# Altium project GLCD_Board.PrjPcb
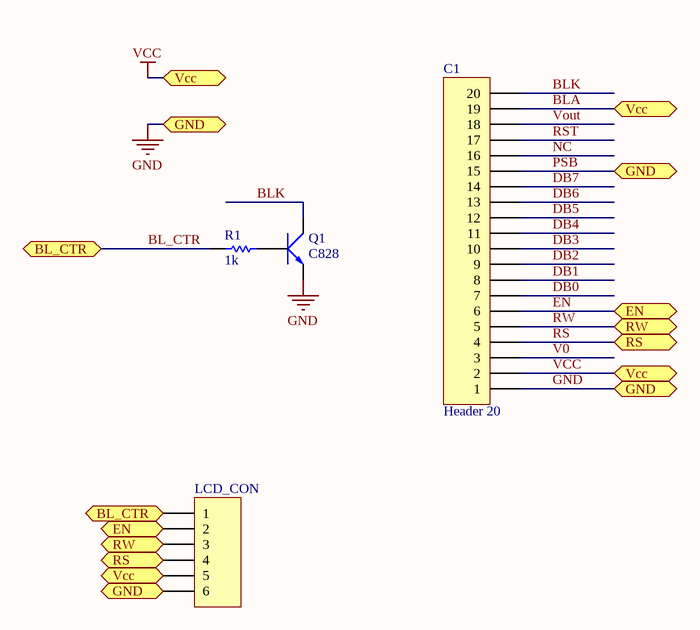
[diagram p0: GLCD_Board.SchDoc]
1 sheet, 4 parts. Net scope: flat (ports and power ports of the same name join across sheets).
Board file: GLCD_Board.PcbDoc

## Sheet GLCD_Board.SchDoc
size A

### Parts
C1  Header 20  [HDR1X20]
LCD_CON  Header 6  [Header 6 way 90]  (value not drawn)
Q1  C828  [SOT23 TOP]
R1  value 1k  [RESC1608N_ZERO]  (hidden comment: Res)

### Ports
BL_CTR, EN, GND, RS, RW, Vcc

### Nets
BLA: C1.2 C1.19 LCD_CON.5 ; port Vcc  [also labelled VCC]
GND: C1.1 C1.15 LCD_CON.6 Q1.3(E) ; port GND  [also labelled PSB]
BL_CTR: LCD_CON.1 R1.1 ; port BL_CTR
BLK: C1.20 Q1.2(C)
DB0: C1.7
DB1: C1.8
DB2: C1.9
DB3: C1.10
DB4: C1.11
DB5: C1.12
DB6: C1.13
DB7: C1.14
EN: C1.6 LCD_CON.2 ; port EN
NC: C1.16
RS: C1.4 LCD_CON.4 ; port RS
RST: C1.17
RW: C1.5 LCD_CON.3 ; port RW
V0: C1.3
Vout: C1.18
NetQ1_1: Q1.1(B) R1.2

### Library data of the parts
C1 = Header 20: Header, 20-Pin; LatestRevisionDate: 17-Jul-2002; LatestRevisionNote: Re-released for DXP Platform.; Publisher: Altium Limited
LCD_CON = Header 6: Header, 6-Pin; LatestRevisionDate: 17-Jul-2002; LatestRevisionNote: Re-released for DXP Platform.; Publisher: Altium Limited
Q1 = NPN: Transistor C828 C1815....